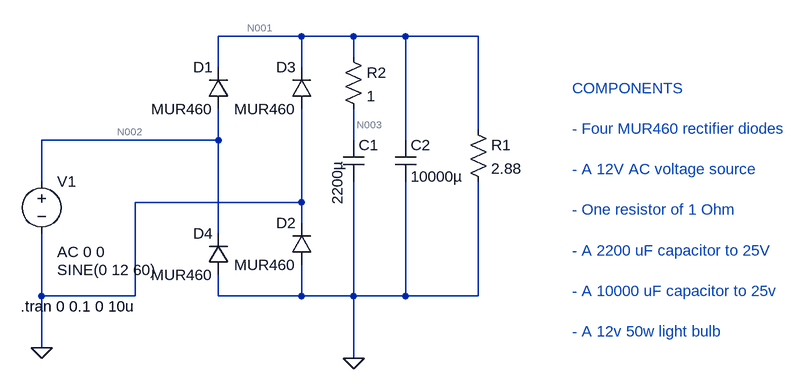
[diagram p0: schematic monofasico.asc]
monofasico.asc, the LTspice schematic file:
Version 4.1
SHEET 1 2020 680
WIRE -144 -208 -272 -208
WIRE -64 -208 -144 -208
WIRE 16 -208 -64 -208
WIRE 128 -208 16 -208
WIRE -64 -176 -64 -208
WIRE -272 -160 -272 -208
WIRE -144 -160 -144 -208
WIRE 128 -64 128 -208
WIRE -272 -48 -272 -96
WIRE -272 -48 -544 -48
WIRE -64 -48 -64 -96
WIRE 16 -48 16 -208
WIRE -544 16 -544 -48
WIRE -144 48 -144 -96
WIRE -144 48 -400 48
WIRE -144 80 -144 48
WIRE -272 96 -272 -48
WIRE -544 192 -544 96
WIRE -400 192 -400 48
WIRE -400 192 -544 192
WIRE -272 192 -272 160
WIRE -144 192 -144 144
WIRE -144 192 -272 192
WIRE -64 192 -64 16
WIRE -64 192 -144 192
WIRE 16 192 16 16
WIRE 16 192 -64 192
WIRE 128 192 128 16
WIRE 128 192 16 192
WIRE -544 272 -544 192
WIRE -64 288 -64 192
FLAG -544 272 0
FLAG -64 288 0
SYMBOL voltage -544 0 R0
WINDOW 3 24 152 Left 2
WINDOW 123 24 124 Left 2
WINDOW 39 0 0 Left 0
SYMATTR Value SINE(0 12 60)
SYMATTR Value2 AC 0 0
SYMATTR InstName V1
SYMBOL diode -256 -96 R180
WINDOW 0 24 64 Left 2
WINDOW 3 24 0 Left 2
SYMATTR InstName D1
SYMATTR Value MUR460
SYMBOL diode -128 144 R180
WINDOW 0 24 64 Left 2
WINDOW 3 24 0 Left 2
SYMATTR InstName D2
SYMATTR Value MUR460
SYMBOL diode -128 -96 R180
WINDOW 0 24 64 Left 2
WINDOW 3 24 0 Left 2
SYMATTR InstName D3
SYMATTR Value MUR460
SYMBOL diode -256 160 R180
WINDOW 0 24 64 Left 2
WINDOW 3 24 0 Left 2
SYMATTR InstName D4
SYMATTR Value MUR460
SYMBOL cap -80 -48 R0
WINDOW 3 -9 100 VLeft 2
SYMATTR Value 2200µ
SYMATTR InstName C1
SYMATTR SpiceLine V=25 Irms=1.2 Rser=0.044 Lser=13.616n mfg="Würth Elektronik" pn="860020478022 WCAP-ATG5 13x25" type="Al electrolytic"
SYMBOL res 112 -80 R0
SYMATTR InstName R1
SYMATTR Value 2.88
SYMATTR SpiceLine tol=5 pwr=50
SYMBOL cap 0 -48 R0
WINDOW 3 24 56 Left 2
SYMATTR InstName C2
SYMATTR Value 10000µ
SYMATTR Description Capacitor
SYMATTR Type cap
SYMATTR SpiceLine V=25 Irms=3.96 Rser=0.0225 Lser=41.2n mfg="Würth Elektronik" pn="860010483029 WCAP-ATG8 22x41" type="Al electrolytic"
SYMBOL res -80 -192 R0
SYMATTR InstName R2
SYMATTR Value 1
TEXT -576 208 Left 2 !.tran 0 0.1 0 10u
TEXT 272 -128 Left 2 ;COMPONENTS\n \n- Four MUR460 rectifier diodes\n \n- A 12V AC voltage source\n \n- One resistor of 1 Ohm\n \n- A 2200 uF capacitor to 25V\n \n- A 10000 uF capacitor to 25v\n \n- A 12v 50w light bulb

The netlist it stands for:
* monofasico.asc
V1 N002 0 SINE(0 12 60) AC 0 0
D1 N002 N001 MUR460
D2 0 0 MUR460
D3 0 N001 MUR460
D4 0 N002 MUR460
C1 N003 0 2200µ V=25 Irms=1.2 Rser=0.044 Lser=13.616n mfg="Würth Elektronik" pn="860020478022 WCAP-ATG5 13x25" type="Al electrolytic"
R1 N001 0 2.88 tol=5 pwr=50
C2 N001 0 10000µ V=25 Irms=3.96 Rser=0.0225 Lser=41.2n mfg="Würth Elektronik" pn="860010483029 WCAP-ATG8 22x41" type="Al electrolytic"
R2 N001 N003 1
.model D D
.lib standard.dio
.tran 0 0.1 0 10u
* COMPONENTS
* - Four MUR460 rectifier diodes
* - A 12V AC voltage source
* - One resistor of 1 Ohm
* - A 2200 uF capacitor to 25V
* - A 10000 uF capacitor to 25v
* - A 12v 50w light bulb
.backanno
.end

* Results of the author's LTspice run, read from the files saved beside the schematic
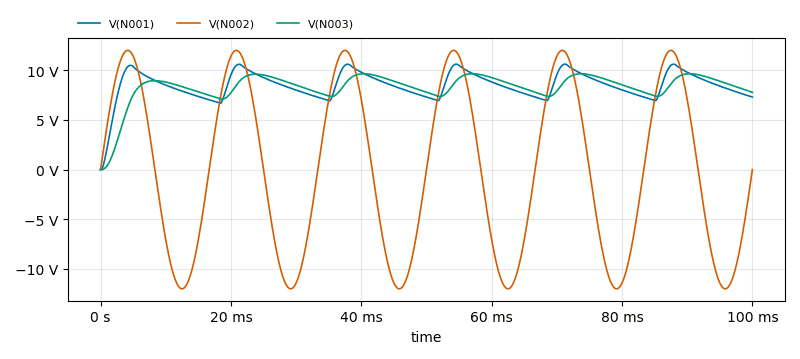
[diagram p1: Transient Analysis of monofasico.asc, plotted from the saved traces]
* Transient Analysis, 1 run:
*   V(N001): min 0 V, max 10.61 V, average 8.482 V, rms 8.6 V, last 7.3 V
*   V(N002): min -12 V, max 12 V, average 0 V, rms 8.485 V, last 0 V
*   V(N003): min 0 V, max 9.645 V, average 8.311 V, rms 8.445 V, last 7.776 V